# Altium schematic sheet POWER.SchDoc
size A4
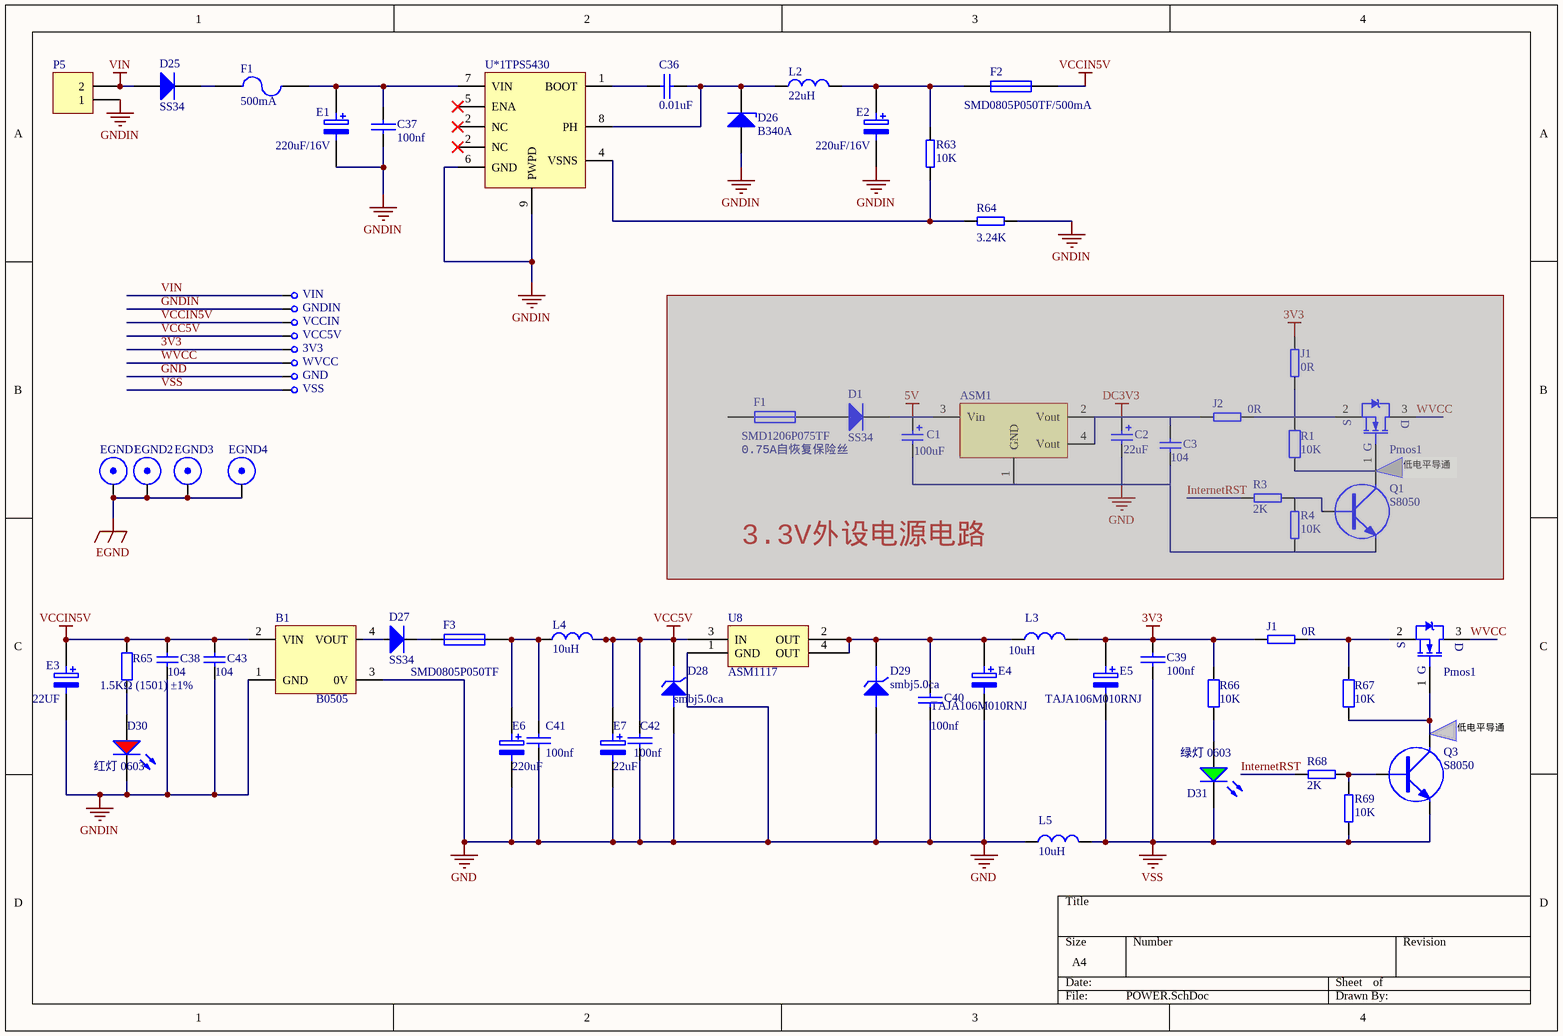
[diagram p0: POWER.SchDoc]

## Parts
(Parts that share a designator on the sheet are numbered #1, #2 ... from top to bottom, then left to right.)
3V3  CHECK  [CHECK-B]  (value not drawn)
ASM1  ASM1117-3.3  [LC-SOT-223]  (value not drawn)  (masked out: inside a compile mask, not in the netlist)
B1  B0505  [B0505D-1WR2]
C1  100uF  [HONOR_63X54]  (masked out: inside a compile mask, not in the netlist)
C2  22uF  [HONOR_63X54]  (masked out: inside a compile mask, not in the netlist)
C3  104  [LC-0603_C]  (masked out: inside a compile mask, not in the netlist)
C36  0.01uF  [C-0805]
C37  100nf  [1206]
C38  104  [LC-0603_C]
C39  100nf  [LC-0603_C]
C40  100nf  [LC-0603_C]
C41  100nf  [LC-0603_C]
C42  100nf  [LC-0603_C]
C43  104  [LC-0603_C]
D1  SS34  [LC-SMA(DO-214AC)_S5]  (masked out: inside a compile mask, not in the netlist)
D25  SS34  [D-SMA]
D26  value B340A  [D-SMB]  (hidden comment: Diode-Z)
D27  SS34  [D-SMA]
D28  smbj5.0ca  [LC-SMB(DO-214AA)_S1]
D29  smbj5.0ca  [LC-SMB(DO-214AA)_S1]
D30  红灯 0603  [LC-0603_LED_S1]
D31  绿灯 0603  [LC-0603_LED_S1]
E1  220uF/16V  [C-RB-SD6]
E2  220uF/16V  [C-RB-SD6]
E3  22UF  [C-RB-SD6]
E4  TAJA106M010RNJ  [LC-CASE-A_3216]
E5  TAJA106M010RNJ  [LC-CASE-A_3216]
E6  220uF  [C-RB-SD6]
E7  22uF  [C-RB-SD6]
EGND1  EGND  [H-6-3.2m]  (value not drawn)
EGND2  EGND  [H-6-3.2m]  (value not drawn)
EGND3  EGND  [H-6-3.2m]  (value not drawn)
EGND4  EGND  [H-6-3.2m]  (value not drawn)
F1#1  value 500mA  [1206]  (hidden comment: Fuse2)
F1#2  SMD1206P075TF  [LC-1206_R]  (masked out: inside a compile mask, not in the netlist)
F2  SMD0805P050TF/500mA  [0805-1]
F3  SMD0805P050TF  [0805-1]
GND  CHECK  [CHECK-B]  (value not drawn)
GNDIN  CHECK  [CHECK-B]  (value not drawn)
J1#1  0R  [LC-0603_L]  (masked out: inside a compile mask, not in the netlist)
J1#2  0R  [LC-0603_L]
J2  0R  [LC-0603_L]  (masked out: inside a compile mask, not in the netlist)
L2  value 22uH  [L-SMD-7]  (hidden comment: Inductor)
L3  value 10uH  [0805-1]  (hidden comment: Inductor)
L4  value 10uH  [L-SMD-3]  (hidden comment: Inductor)
L5  value 10uH  [0805-1]  (hidden comment: Inductor)
P5  Header 2  [WJ2EDGR508-2]  (value not drawn)
Pmos1#1  SI2301  [LC-SOT-23(SOT-23-3)]  (value not drawn)  (masked out: inside a compile mask, not in the netlist)
Pmos1#2  SI2301  [LC-SOT-23(SOT-23-3)]  (value not drawn)
Q1  S8050  [LC-SOT-23(SOT-23-3)]  (masked out: inside a compile mask, not in the netlist)
Q3  S8050  [LC-SOT-23(SOT-23-3)]
R1  10K  [LC-0603_R]  (masked out: inside a compile mask, not in the netlist)
R3  2K  [LC-0603_R]  (masked out: inside a compile mask, not in the netlist)
R4  10K  [LC-0603_R]  (masked out: inside a compile mask, not in the netlist)
R63  10K  [LC-0603_R]
R64  3.24K  [LC-0603_R]
R65  1.5KΩ (1501) ±1%  [LC-0603_R]
R66  10K  [LC-0603_R]
R67  10K  [LC-0603_R]
R68  2K  [LC-0603_R]
R69  10K  [LC-0603_R]
U8  ASM1117  [SOT223]
U*1  TPS5430  [SOIC8]
VCC5V  CHECK  [CHECK-B]  (value not drawn)
VCCIN  CHECK  [CHECK-B]  (value not drawn)
VIN  CHECK  [CHECK-B]  (value not drawn)
VSS  CHECK  [CHECK-B]  (value not drawn)
WVCC  CHECK  [CHECK-B]  (value not drawn)

## Nets
3V3: 3V3.1 C39.2 E5.1 J1#2.2 L3.2 R66.1
EGND: EGND1.0 EGND2.0 EGND3.0 EGND4.0
GND: B1.3(0V) C40.1 C41.1 C42.1 D28.1(A) D29.1(A) E4.2 E6.2 E7.2 GND.1 L5.1 U8.1(GND)
GNDIN: B1.1(GND) C37.1 C38.2 C43.2 D26.1(A) D30.K E1.2 E2.2 E3.2 GNDIN.1 P5.1 R64.1 U*1.6(GND) U*1.9(PWPD)
VCC5V: C42.2 D28.2(K) E7.1 L4.2 U8.3(IN) VCC5V.1
VCCIN5V: B1.2(VIN) C38.1 C43.1 E3.1 F2.2 R65.2 VCCIN.1
VIN: D25.1(A) P5.2 VIN.1
VSS: C39.1 D31.K E5.2 L5.2 Q3.2 R69.1 VSS.1
InternetRST: R68.2
WVCC: Pmos1#2.3(D) WVCC.1
NetB1_4: B1.4(VOUT) D27.1(A)
NetC36_1: C36.1 D26.2(K) L2.1 U*1.8(PH)
NetC36_2: C36.2 U*1.1(BOOT)
NetC37_2: C37.2 E1.1 F1#1.2 U*1.7(VIN)
NetC40_2: C40.2 D29.2(K) E4.1 L3.1 U8.2(OUT) U8.4(OUT)
NetC41_2: C41.2 E6.1 F3.2 L4.1
NetD25_2: D25.2(K) F1#1.1
NetD27_2: D27.2(K) F3.1
NetD30_A: D30.A R65.1
NetD31_A: D31.A R66.2
NetE2_1: E2.1 F2.1 L2.2 R63.2
NetJ1#2_1: J1#2.1 Pmos1#2.2(S) R67.2
NetPmos1#2_1: Pmos1#2.1(G) Q3.3 R67.1
NetQ3_1: Q3.1 R68.1 R69.2
NetR63_1: R63.1 R64.2 U*1.4(VSNS)

Not connected (* = marked no-connect by the designer): U*1 2(NC)* 5(ENA)*

## Notes on the sheet
- (near F1#2) 0.75A自恢复保险丝
- 低电平导通
- 3.3V外设电源电路
- (near Q3) 低电平导通

## Library data of the parts
3V3 GND GNDIN VCC5V VCCIN VIN VSS WVCC = CHECK: 测试点
ASM1 = VOLTREG1
C1 C2 = Cap Pol1: Polarized Capacitor (Radial); Published: 8-Jun-2000; Revision: July-2002: Re-released for DXP Platform.; Publisher: Altium Limited
  C1: Value: 100uF
  C2: Value: 22uF
C3 C38 C43 = Cap: Capacitor; Value: 100nF; Published: 8-Jun-2000; Revision: July-2002: Re-released for DXP Platform.; Publisher: Altium Limited
C36 C37 C39-C42 = CAP: Capacitor
D1 = Diode: Default Diode; Published: 8-Jun-2000; LatestRevisionDate: 17-Jul-2002; LatestRevisionNote: Re-released for DXP Platform.; PackageDocument: Sep-1996; PackageReference: SMC; Publisher: Altium Limited; Code_JEDEC: DO-214-AB
D25 D27 = Diode: 二极管; Published: 8-Jun-2000; LatestRevisionDate: 17-Jul-2002; LatestRevisionNote: Re-released for DXP Platform.; PackageDocument: Sep-1996; PackageReference: SMC; Publisher: Altium Limited; Code_JEDEC: DO-214-AB
D26 = Diode-Z: 稳压二极管; Published: 8-Jun-2000; LatestRevisionDate: 17-Jul-2002; LatestRevisionNote: Re-released for DXP Platform.; PackageReference: SMB; Publisher: Altium Limited; Code_JEDEC: DO-214-AA
D28 D29 = ZENER3: Zener Diode
D30 = 0603 红灯: 发光二极管; ComponentLink1Description: 供应商链接; ComponentLink1URL: http://www.szlcsc.com/product/details_2659.html; Package: 0603; Supplier: LC; SuppliersPartNumber: C2286
D31 = 0603 绿灯: 发光二极管; ComponentLink1Description: 供应商链接; ComponentLink1URL: http://www.szlcsc.com/product/details_73152.html; Package: 0603; Supplier: LC; SuppliersPartNumber: C72043
E1-E7 = ELECTRO2: Electrolytic Capacitor
F1#1 = Fuse2: 可恢复保险丝; Published: 8-Jun-2000; LatestRevisionDate: 17-Jul-2002; LatestRevisionNote: Re-released for DXP Platform.; PackageReference: PIN-W2/E2.8; Publisher: Altium Limited
F1#2 F2 F3 = Fuse 1: Fuse; Published: 8-Jun-2000; LatestRevisionDate: 17-Jul-2002; LatestRevisionNote: Re-released for DXP Platform.; PackageReference: PIN-W2/E2.8; Publisher: Altium Limited
J1#1 J1#2 J2 R3 R4 R68 R69 = RES
L2-L5 = Inductor: 电感; Code_IEC: 1005; Published: 8-Jun-2000; LatestRevisionDate: 17-Jul-2002; LatestRevisionNote: Re-released for DXP Platform.; PackageReference: 0402-A; Publisher: Altium Limited; Code_JEITA: 0402
P5 = Header 2: Header, 2-Pin; LatestRevisionDate: 17-Jul-2002; LatestRevisionNote: Re-released for DXP Platform.; Publisher: Altium Limited
Pmos1#1 Pmos1#2 = N-MOS
Q1 Q3 = NPN
R1 R67 = Res2: Resistor; Published: 8-Jun-2000; LatestRevisionDate: 17-Jul-2002; LatestRevisionNote: Re-released for DXP Platform.; PackageReference: AXIAL-0.4; Publisher: Altium Limited; Value: 10K
R63 R64 = RES2
R65 = 0603 1.5KΩ (1501) 1%: 贴片电阻; ComponentLink1Description: 供应商链接; ComponentLink1URL: http://www.szlcsc.com/product/details_23570.html; Package: 0603; Supplier: LC; SuppliersPartNumber: C22843
R66 = Res2: Resistor; Value: 1K; Published: 8-Jun-2000; LatestRevisionDate: 17-Jul-2002; LatestRevisionNote: Re-released for DXP Platform.; PackageReference: AXIAL-0.4; Publisher: Altium Limited
U8 = ASM1: 3.3V稳压芯片